# EAGLE design Trd_pcb (EAGLE 9.6.2)
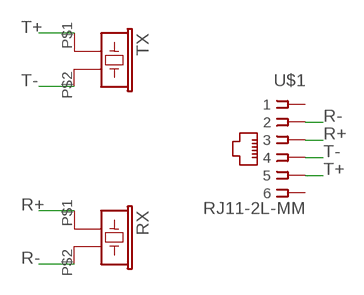
[diagram p0: schematic, sheet 1]

## Parts
RX  400ST/R100  [DIA-9.7-5]
TX  400ST/R100  [DIA-9.7-5]
U$1  RJ11-2L-MM  [RJ11-NO_SHIELD_2]

## Nets
R+: RX.P$1 U$1.3
R-: RX.P$2 U$1.2
T+: TX.P$1 U$1.5
T-: TX.P$2 U$1.4
Unconnected: U$1.1 U$1.6

## Library data of the parts
RX TX = Transductor:400ST/R100
U$1 = RJ11_RSA:RJ11-2L-MM

## Board
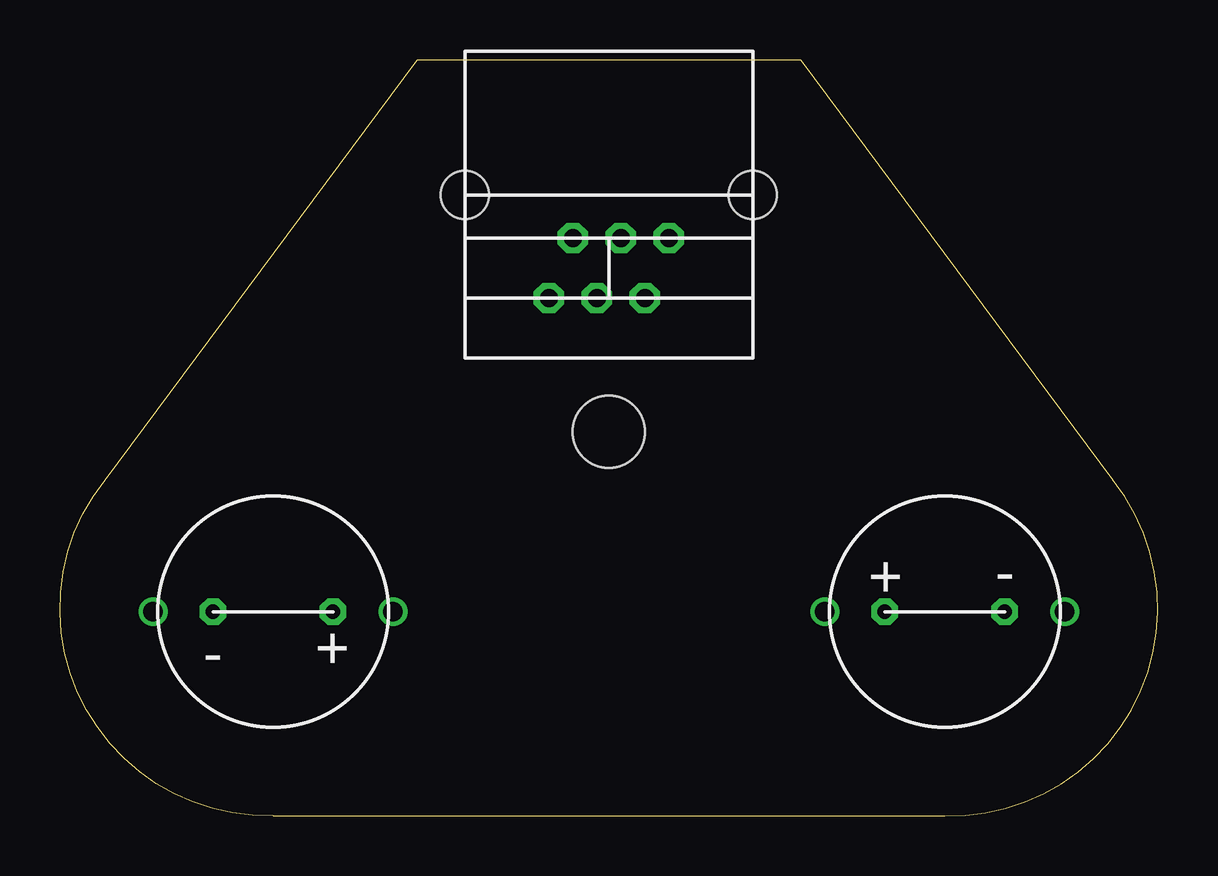
[diagram p1: board, top side]
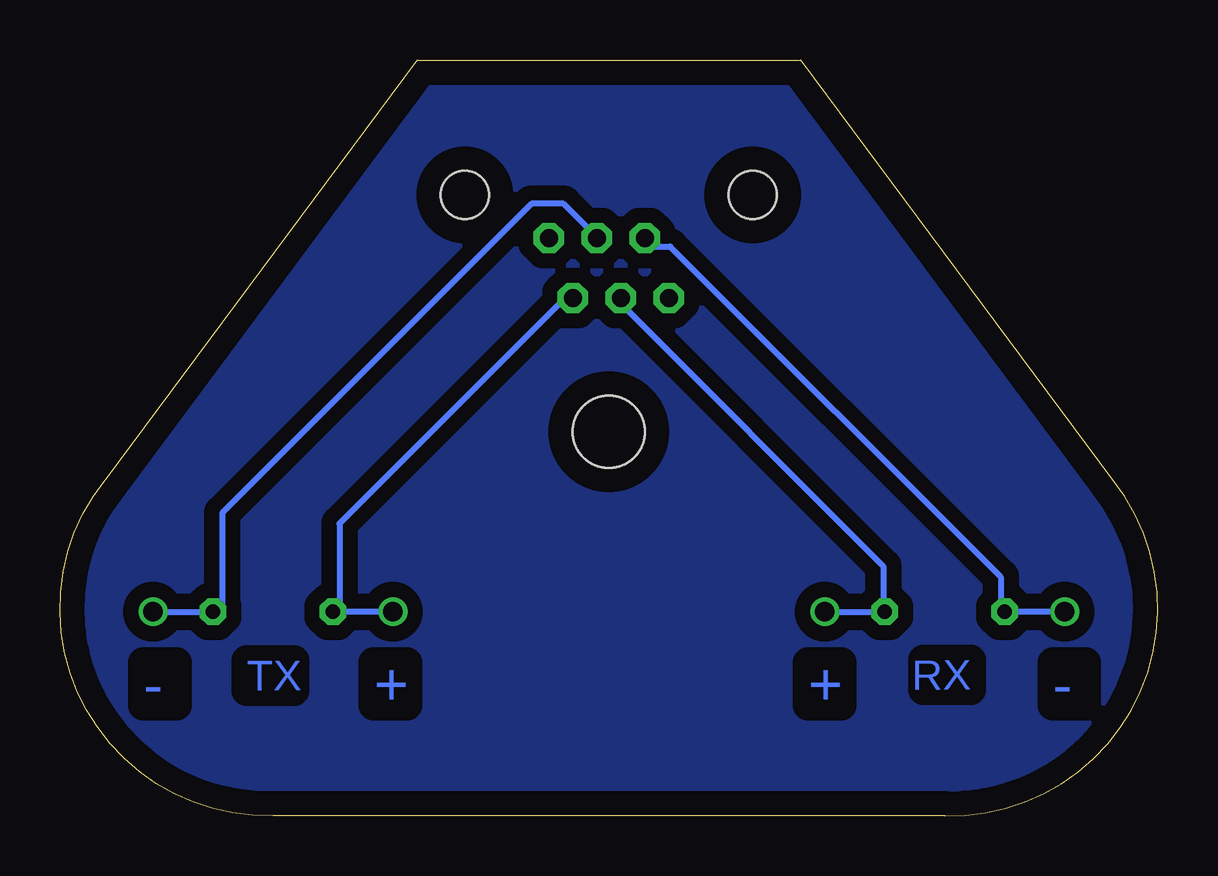
[diagram p2: board, bottom side, seen from below]

Size 45.76 x 31.5 mm. Coordinates in mm from the lower left corner, seen from the top.
Outline: 30.88,31.5 14.88,31.5 1.88,14 arc130 8.88,0 36.88,0 arc130 43.88,14 30.88,31.5
Copper layers (1*16): Top 0.035mm / dielectric 1.5mm / Bottom 0.035mm
Design rules "default *": minimum track width 10mil, minimum drill 24mil, track to track 25mil, track to pad 25mil, pad to pad 25mil, via to via 25mil, smd to smd 8mil, copper to edge 40mil, drill to drill 8mil, minimum pad ring 10mil, minimum via ring 8mil, stop-mask expansion 4mil, vias tented up to drill 0mil, thermal gap 10mil
Holes 3 mm at 22.88,16

### Footprints (pad centres in the part's own frame; a part is rotated, then mirrored left to right if it is on the bottom)
DIA-9.7-5 = drill 0.6 octagon: P$1 -2.5,0; P$2 2.5,0
RJ11-NO_SHIELD_2 = drill 0.75 octagon: 1 -2.5,-7.3; 2 -1.5,-4.8; 3 -0.5,-7.3; 4 0.5,-4.8; 5 1.5,-7.3; 6 2.5,-4.8 | hole 2: -6,-3; 6,-3

### Placement (x,y rotation side)
RX  8.88,8.5 180 top
TX  36.88,8.5 0 top
U$1  22.88,28.87 0 top

### Tracks (layer width: path | path; a pad name or v marks a point on that pad's centre or on a via)
N$1
  pour Bottom: 15.38,31 30.38,31 43.88,13 45.38,8 43.38,3.5 37.88,0.5 7.88,0.5 2.38,3.5 0.38,9 2.38,13.5
R+  (via drill 0.8)
  Bottom 0.254: U$1.3 22.55,21.5 11.44,10.39 11.44,8.61 RX.P$1 v13.88,8.5
R-  (via drill 0.8)
  Bottom 0.254: U$1.2 21.22,23.73 20.33,23.73 6.55,9.95 6.55,8.61 RX.P$2 v3.88,8.5
T+  (via drill 0.8)
  Bottom 0.254: U$1.5 24.77,21.5 34.11,12.17 34.11,8.61 TX.P$1 v31.88,8.5
T-  (via drill 0.8)
  Bottom 0.254: U$1.4 23.44,24.17 24.77,25.5 26.1,25.5 39,12.61 39,8.61 TX.P$2 v41.88,8.5

### Text on the board
Bottom: - | + | + | -